# EAGLE design eCog_UART_Template (EAGLE 6.6.0)
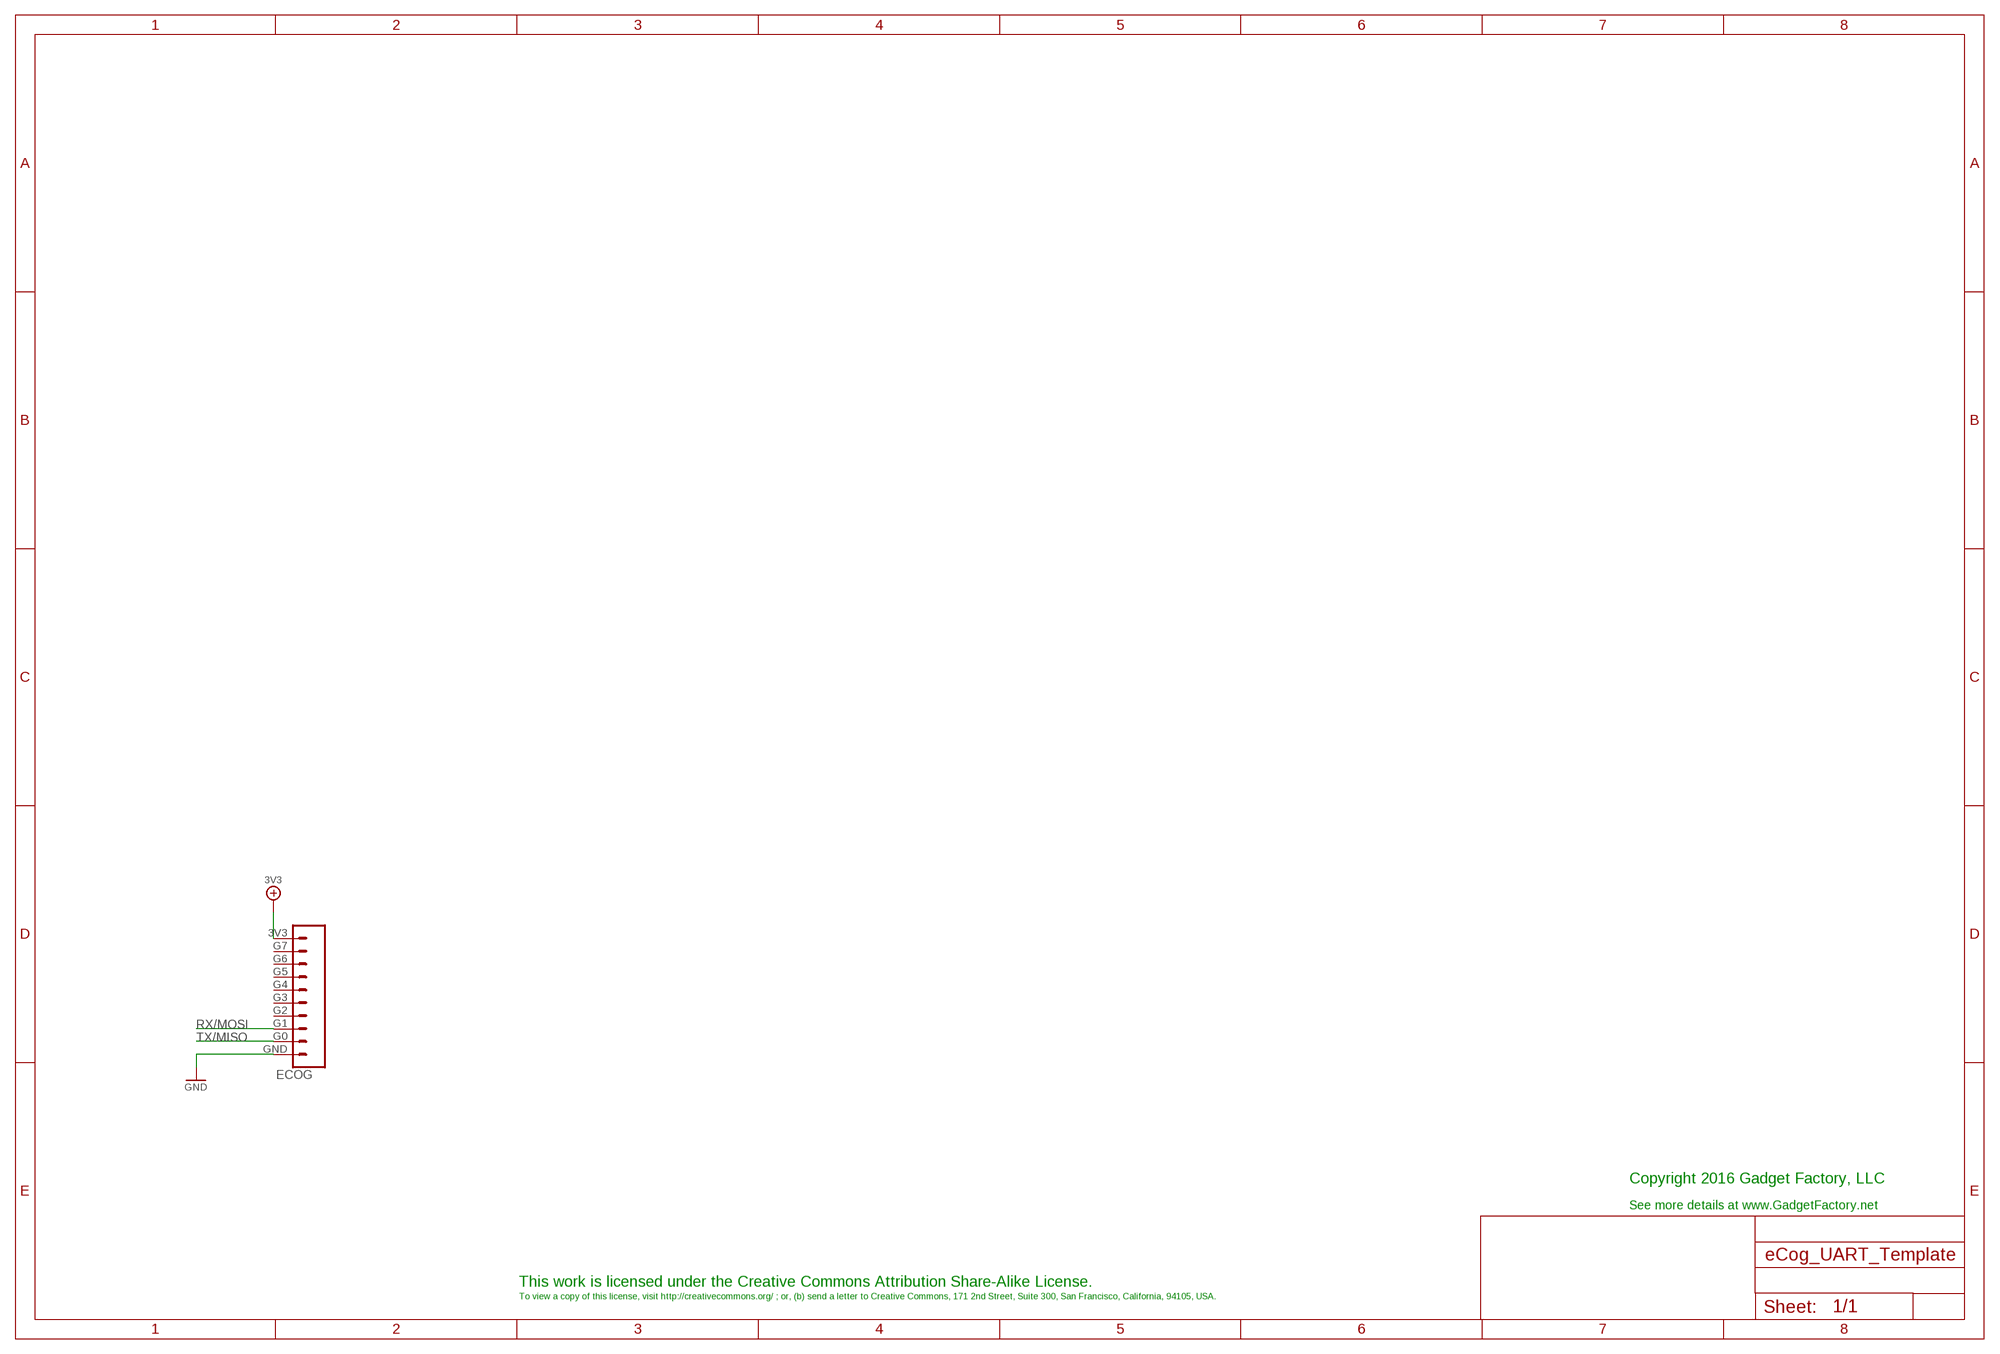
[diagram p0: schematic, sheet 1]

## Parts
ECOG  ECOG_GENERAL_ROWECOG_GENERAL_SMD  [ECOG_GENERAL_SMD]

## Nets
3V3: ECOG.3V3
GND: ECOG.GND
RX/MOSI: ECOG.G1
TX/MISO: ECOG.G0
Unconnected: ECOG.G2 ECOG.G3 ECOG.G4 ECOG.G5 ECOG.G6 ECOG.G7

## Notes on the sheet
- Copyright 2016 Gadget Factory, LLC
- See more details at www.GadgetFactory.net
- This work is licensed under the Creative Commons Attribution Share-Alike License.
- To view a copy of this license, visit http://creativecommons.org/ ; or, (b) send a letter to Creative Commons, 171 2nd Street, Suite 300, San Francisco, California, 94105, USA.

## Library data of the parts
ECOG = eCogs:ECOG_GENERAL_ROW; DIGIKEY: S1013EC-10-ND

## Board
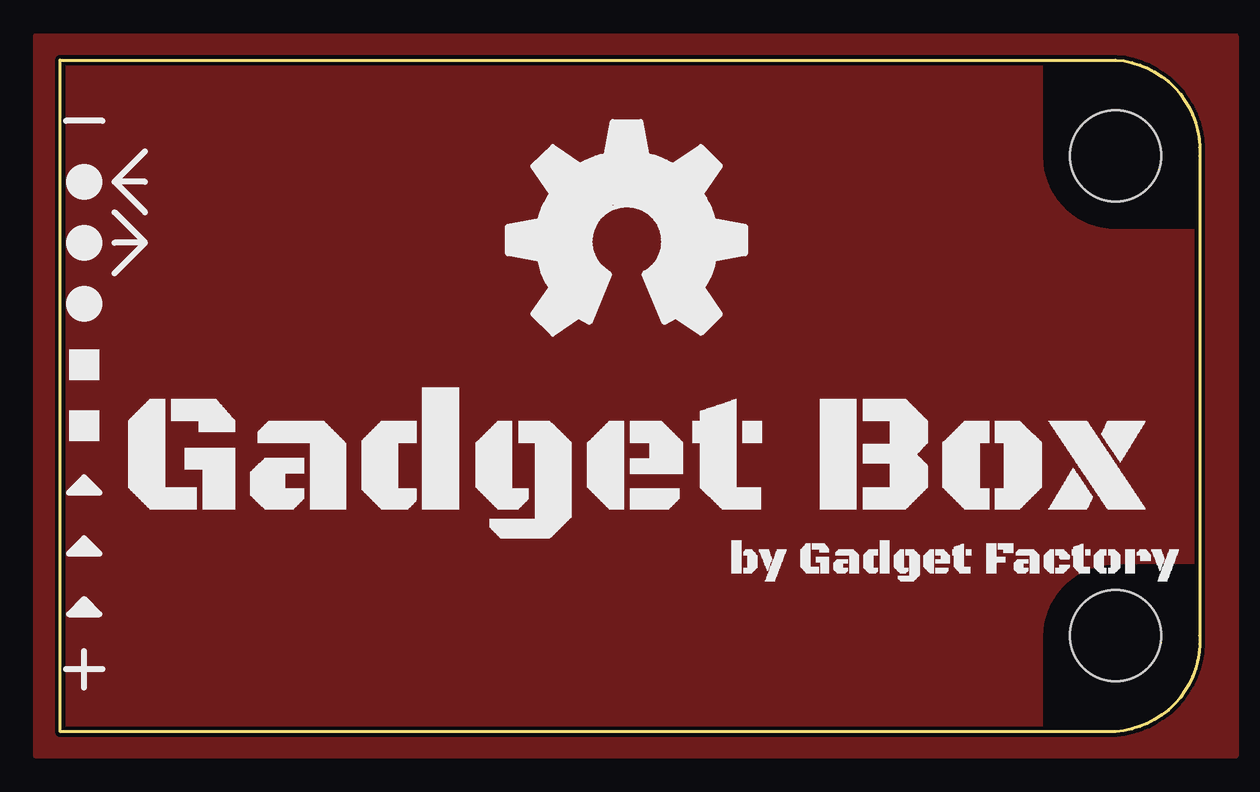
[diagram p1: board, top side]
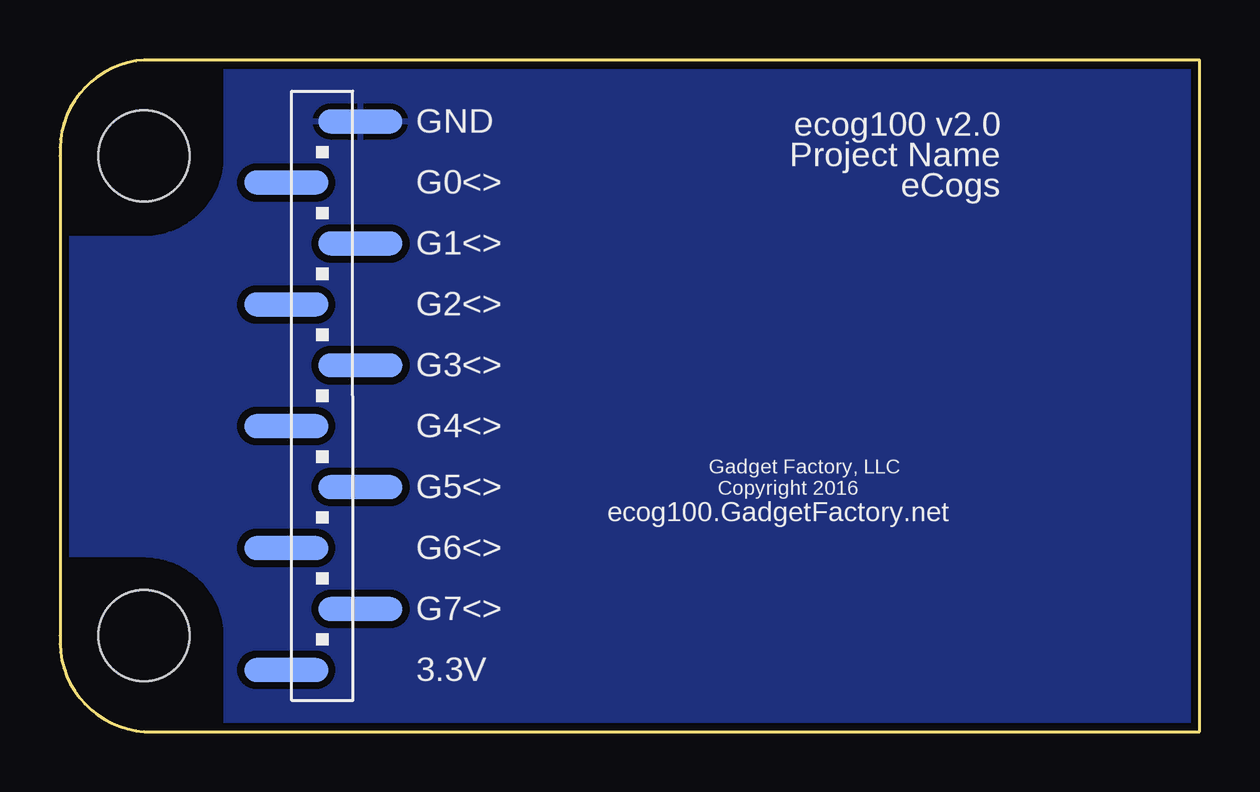
[diagram p2: board, bottom side, seen from below]

Size 47.51 x 28 mm. Coordinates in mm from the lower left corner, seen from the top.
Copper layers (1*16): Top 0.035mm / dielectric 1.5mm / Bottom 0.035mm
Design rules "hackvana *": minimum track width 6mil, minimum drill 0.3mm, track to track 6mil, track to pad 6mil, pad to pad 6mil, via to via 6mil, smd to smd 0mil, copper to edge 6mil, drill to drill 6mil, minimum pad ring 10mil, minimum via ring 6mil, stop-mask expansion 2mil, vias tented up to drill 100mil, thermal gap 10mil

### Footprints (pad centres in the part's own frame; a part is rotated, then mirrored left to right if it is on the bottom)
ECOG_GENERAL_SMD = smd 3.5 x 1 bottom: 3V3 9.923,25.429; G0 9.923,5.111; G1 13.022,7.649; G2 9.923,10.189; G3 13.022,12.729; G4 9.923,15.269; G5 13.022,17.809; G6 9.923,20.349; G7 13.022,22.889; GND 13.022,2.571 | hole 3.8: 4,24; 4,4

### Placement (x,y rotation side)
ECOG  48,28 180 top
U$1  [GADGETBOX_TEXT]  24.12,10.98 0 top
U$2  [LEGEND_DIO]  1.01,22.92 0 top
U$3  [LEGEND_DIO]  1.01,20.38 0 top
U$4  [LEGEND_DIO]  1.01,17.84 0 top
U$5  [LEGEND_PWM]  1.01,15.3 0 top
U$6  [LEGEND_PWM]  1.01,12.76 0 top
U$7  [LEGEND_ANALOG]  1.01,10.22 0 top
U$8  [LEGEND_ANALOG]  1.01,7.68 0 top
U$9  [LEGEND_ANALOG]  1.01,5.14 0 top
U$10  [OSHW_FILLX350_NOTEXT]  18.66,16.57 0 top

### Tracks (layer width: path | path; a pad name or v marks a point on that pad's centre or on a via)
3V3
  pour Top: 49,-1 -1,-1 -1,29 49,29
GND
  pour Bottom (isolate 0.305): 50,-2 -2,-2 -2,30 50,30

### Text on the board
bPlace: ecog100 v2.0 | Project Name | GND | eCogs | G0<> | G1<> | G2<> | G3<> | G4<> | Gadget Factory, LLC | ecog100.GadgetFactory.net | Copyright 2016 | G5<> | G6<> | G7<> | 3.3V